# Altium schematic sheet Step Down.SchDoc
size A; SheetNumber: 3; SheetTotal: 3
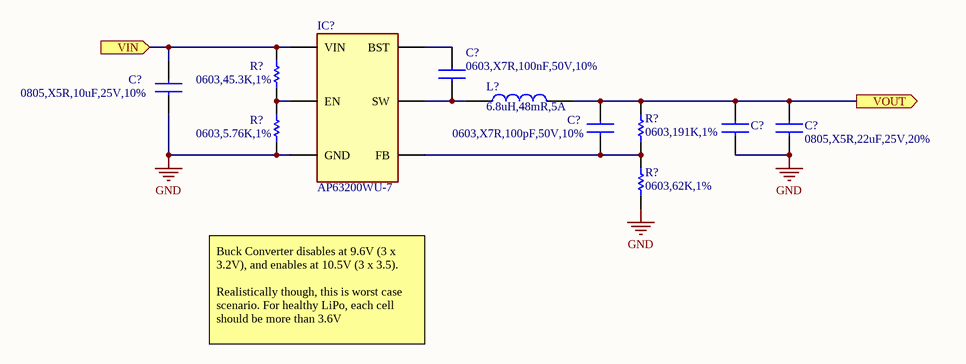
[diagram p0: Step Down.SchDoc]

## Parts
(Parts that share a designator on the sheet are numbered #1, #2 ... from top to bottom, then left to right.)
C?#1  0603,X7R,100nF,50V,10%  [CAPC1608X90N]
C?#2  0805,X5R,10uF,25V,10%  [CAPC2012X145N]
C?#3  0603,X7R,100pF,50V,10%  [CAPC1608X90N]
C?#4  0805,X5R,22uF,25V,20%  [CAPC2012X145N]  (value not drawn)
C?#5  0805,X5R,22uF,25V,20%  [CAPC2012X145N]
IC?  AP63200WU-7  [SOT95P280X100-6N]
L?  6.8uH,48mR,5A  [IND-SMD_L7.0-W6.6]
R?#1  0603,45.3K,1%  [RESC1608X55N]
R?#2  0603,5.76K,1%  [RESC1608X55N]
R?#3  0603,191K,1%  [RESC1608X55N]
R?#4  0603,62K,1%  [RESC1608X55N]

## Ports
VIN (in), VOUT (out)

## Nets
GND: C?#2.1 C?#4.1 C?#5.1 IC?.4(GND) R?#2.1 R?#4.1
VIN: C?#2.2 IC?.3(VIN) R?#1.2 ; port VIN
VOUT: C?#3.2 C?#4.2 C?#5.2 L?.2 R?#3.2 ; port VOUT
NetC?#1_1: C?#1.1 IC?.5(SW) L?.1
NetC?#1_2: C?#1.2 IC?.6(BST)
NetC?#3_1: C?#3.1 IC?.1(FB) R?#3.1 R?#4.2
NetIC?_2: IC?.2(EN) R?#1.1 R?#2.2

## Notes on the sheet
- Buck Converter disables at 9.6V (3 x 3.2V), and enables at 10.5V (3 x 3.5).
  Realistically though, this is worst case scenario. For healthy LiPo, each cell should be more than 3.6V

## Library data of the parts
C?#1 = CC0603KRX7R9BB104: 50V 100nF X7R ±10% 0603 Multilayer Ceramic Capacitors MLCC - SMD/SMT ROHS; Manufacturer_Name: YAGEO; Datasheet Link: https://componentsearchengine.com/Datasheets/2/CC0603KRX7R9BB104.pdf; Height: 0.9mm; Manufacturer_Part_Number: CC0603KRX7R9BB104; Mouser Part Number: 603-CC603KRX7R9BB104; Mouser Price/Stock: https://www.mouser.co.uk/ProductDetail/YAGEO/CC0603KRX7R9BB104?qs=vTakOoo5QyLvVCYM2ge8LQ%3D%3D; Arrow Part Number: CC0603KRX7R9BB104; Arrow Price/Stock: https://www.arrow.com/en/products/cc0603krx7r9bb104/yageo?utm_currency=USD&region=europe; LCSC Part #: C14663
C?#2 = CC0805KKX5R8BB106: 10 µF ±10% 25V Ceramic Capacitor X5R 0805 (2012 Metric); Manufacturer_Name: YAGEO; Datasheet Link: https://www.yageo.com/upload/media/product/productsearch/datasheet/mlcc/UPY-GPHC_X5R_4V-to-50V_27.pdf; Height: 1.45mm; Manufacturer_Part_Number: CC0805KKX5R8BB106; Mouser Part Number: 603-CC805KKX5R8BB106; Mouser Price/Stock: https://www.mouser.co.uk/ProductDetail/YAGEO/CC0805KKX5R8BB106?qs=57cj7OiSijm89pM64t1AGQ%3D%3D; Arrow Part Number: CC0805KKX5R8BB106; Arrow Price/Stock: https://www.arrow.com/en/products/cc0805kkx5r8bb106/yageo?utm_currency=USD&region=nac; LCSC Part Number: C89831
C?#3 = CC0603KRX7R9BB101: 50V 100pF X7R ±10% 0603 Multilayer Ceramic Capacitors MLCC - SMD/SMT ROHS; Manufacturer_Name: YAGEO; Datasheet Link: https://componentsearchengine.com/Datasheets/2/CC0603KRX7R9BB104.pdf; Height: 0.9mm; Manufacturer_Part_Number: CC0603KRX7R9BB101; Mouser Part Number: 603-CC603KRX7R9BB104; Mouser Price/Stock: https://www.mouser.co.uk/ProductDetail/YAGEO/CC0603KRX7R9BB104?qs=vTakOoo5QyLvVCYM2ge8LQ%3D%3D; Arrow Part Number: CC0603KRX7R9BB104; Arrow Price/Stock: https://www.arrow.com/en/products/cc0603krx7r9bb104/yageo?utm_currency=USD&region=europe; LCSC Part #: C160903
C?#4 C?#5 = CC0805MKX5R8BB226: 25V 22uF X5R ±20% 0805 Multilayer Ceramic Capacitors MLCC - SMD/SMT ROHS; Manufacturer_Name: YAGEO; Datasheet Link: https://www.yageo.com/upload/media/product/productsearch/datasheet/mlcc/UPY-GPHC_X5R_4V-to-50V_26.pdf; Height: 1.45mm; Manufacturer_Part_Number: CC0805MKX5R8BB226; Mouser Part Number: 603-CC805MKX5R8BB226; Mouser Price/Stock: https://www.mouser.co.uk/ProductDetail/YAGEO/CC0805MKX5R8BB226?qs=WS5Jv%252B%252Bx1qULWDK6O%2FQuig%3D%3D; LCSC Part Number: C784585
IC? = AP63200WU-7: 3.8V to 32V Input, 2A Low Quiescent Current Synchronous Buck Converter with Enhanced EMI Suppression; Manufacturer_Name: Diodes Incorporated; Description: Switching Voltage Regulators DCDC Conv HV Buck TSOT26 T&R 3K; Datasheet Link: https://www.diodes.com//assets/Datasheets/AP63200-AP63201-AP63203-AP63205.pdf; Height: 1mm; Manufacturer_Part_Number: AP63200WU-7; Mouser Part Number: 621-AP63200WU-7; Mouser Price/Stock: https://www.mouser.co.uk/ProductDetail/Diodes-Incorporated/AP63200WU-7?qs=u16ybLDytRZrauj7eRB5tw%3D%3D; Arrow Part Number: AP63200WU-7; Arrow Price/Stock: https://www.arrow.com/en/products/ap63200wu-7/diodes-incorporated?utm_currency=USD&region=nac; LCSC Part #: C2071868
L? = FXL0630-6R8-M: 5A 6.8uH Molded Inductor ±20% 6A SMD,6.6x7mm Power Inductors ROHS; LCSC Part #: C167221
R?#1 = RC0603FR-0745K3L: 100mW Thick Film Resistor 75V ±100ppm/℃ ±1% 45.3kΩ 0603 Chip Resistor - Surface Mount ROHS; Manufacturer_Name: YAGEO; Datasheet Link: https://www.mouser.com/catalog/specsheets/YAGEO_PYu_RC_Group_51_RoHS_L_12.pdf; Height: 0.55mm; Manufacturer_Part_Number: RC0603FR-0745K3L; LCSC Part #: C245971
R?#2 = RC0603FR-075K76L: 100mW Thick Film Resistor 75V ±100ppm/℃ ±1% 5.76kΩ 0603 Chip Resistor - Surface Mount ROHS; Manufacturer_Name: YAGEO; Datasheet Link: https://www.mouser.com/catalog/specsheets/YAGEO_PYu_RC_Group_51_RoHS_L_12.pdf; Height: 0.55mm; Manufacturer_Part_Number: RC0603FR-075K76L; LCSC Part #: C273771
R?#3 = RC0603FR-07191KL: 100mW Thick Film Resistor 75V ±100ppm/℃ ±1% 191kΩ 0603 Chip Resistor - Surface Mount ROHS; Manufacturer_Name: YAGEO; Datasheet Link: https://www.mouser.com/catalog/specsheets/YAGEO_PYu_RC_Group_51_RoHS_L_12.pdf; Height: 0.55mm; Manufacturer_Part_Number: RC0603FR-07191KL; LCSC Part #: C273767
R?#4 = RC0603FR-0762KL: 100mW Thick Film Resistor 75V ±100ppm/℃ ±1% 62kΩ 0603 Chip Resistor - Surface Mount ROHS; Manufacturer_Name: YAGEO; Datasheet Link: https://www.mouser.com/catalog/specsheets/YAGEO_PYu_RC_Group_51_RoHS_L_12.pdf; Height: 0.55mm; Manufacturer_Part_Number: RC0603FR-0762KL; LCSC Part #: C137694